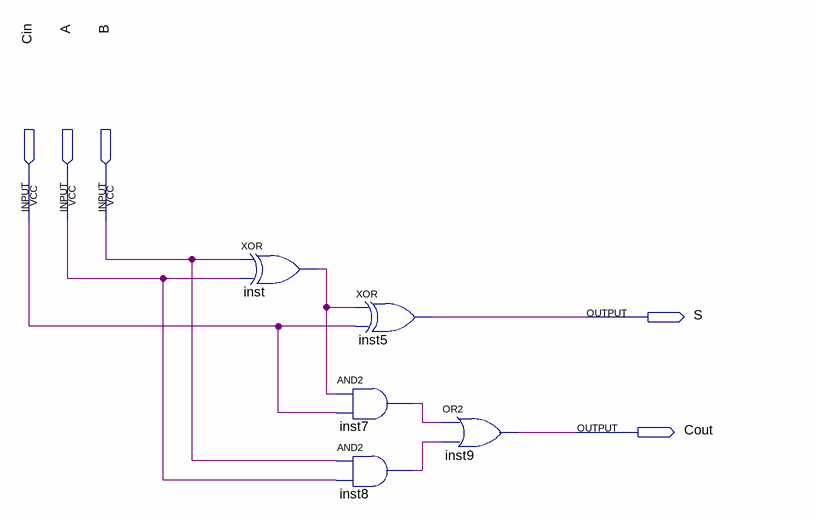
[diagram p0: schematic sheet]
// Quartus schematic Block1.bdf as structural Verilog: 5 symbols, 5 pins
module Block1 (
  input  Cin,
  input  A,
  input  B,
  output S,
  output Cout
);

  wire inst7_out, inst8_out, inst_out;

  xor inst (inst_out, B, A);
  and inst7 (inst7_out, inst_out, Cin);
  and inst8 (inst8_out, B, A);
  xor inst5 (S, inst_out, Cin);
  or inst9 (Cout, inst7_out, inst8_out);
endmodule
